# Altium schematic sheet Плата 347.SchDoc
size 420 x 297 mm; SheetNumber: 2; SheetTotal: 5
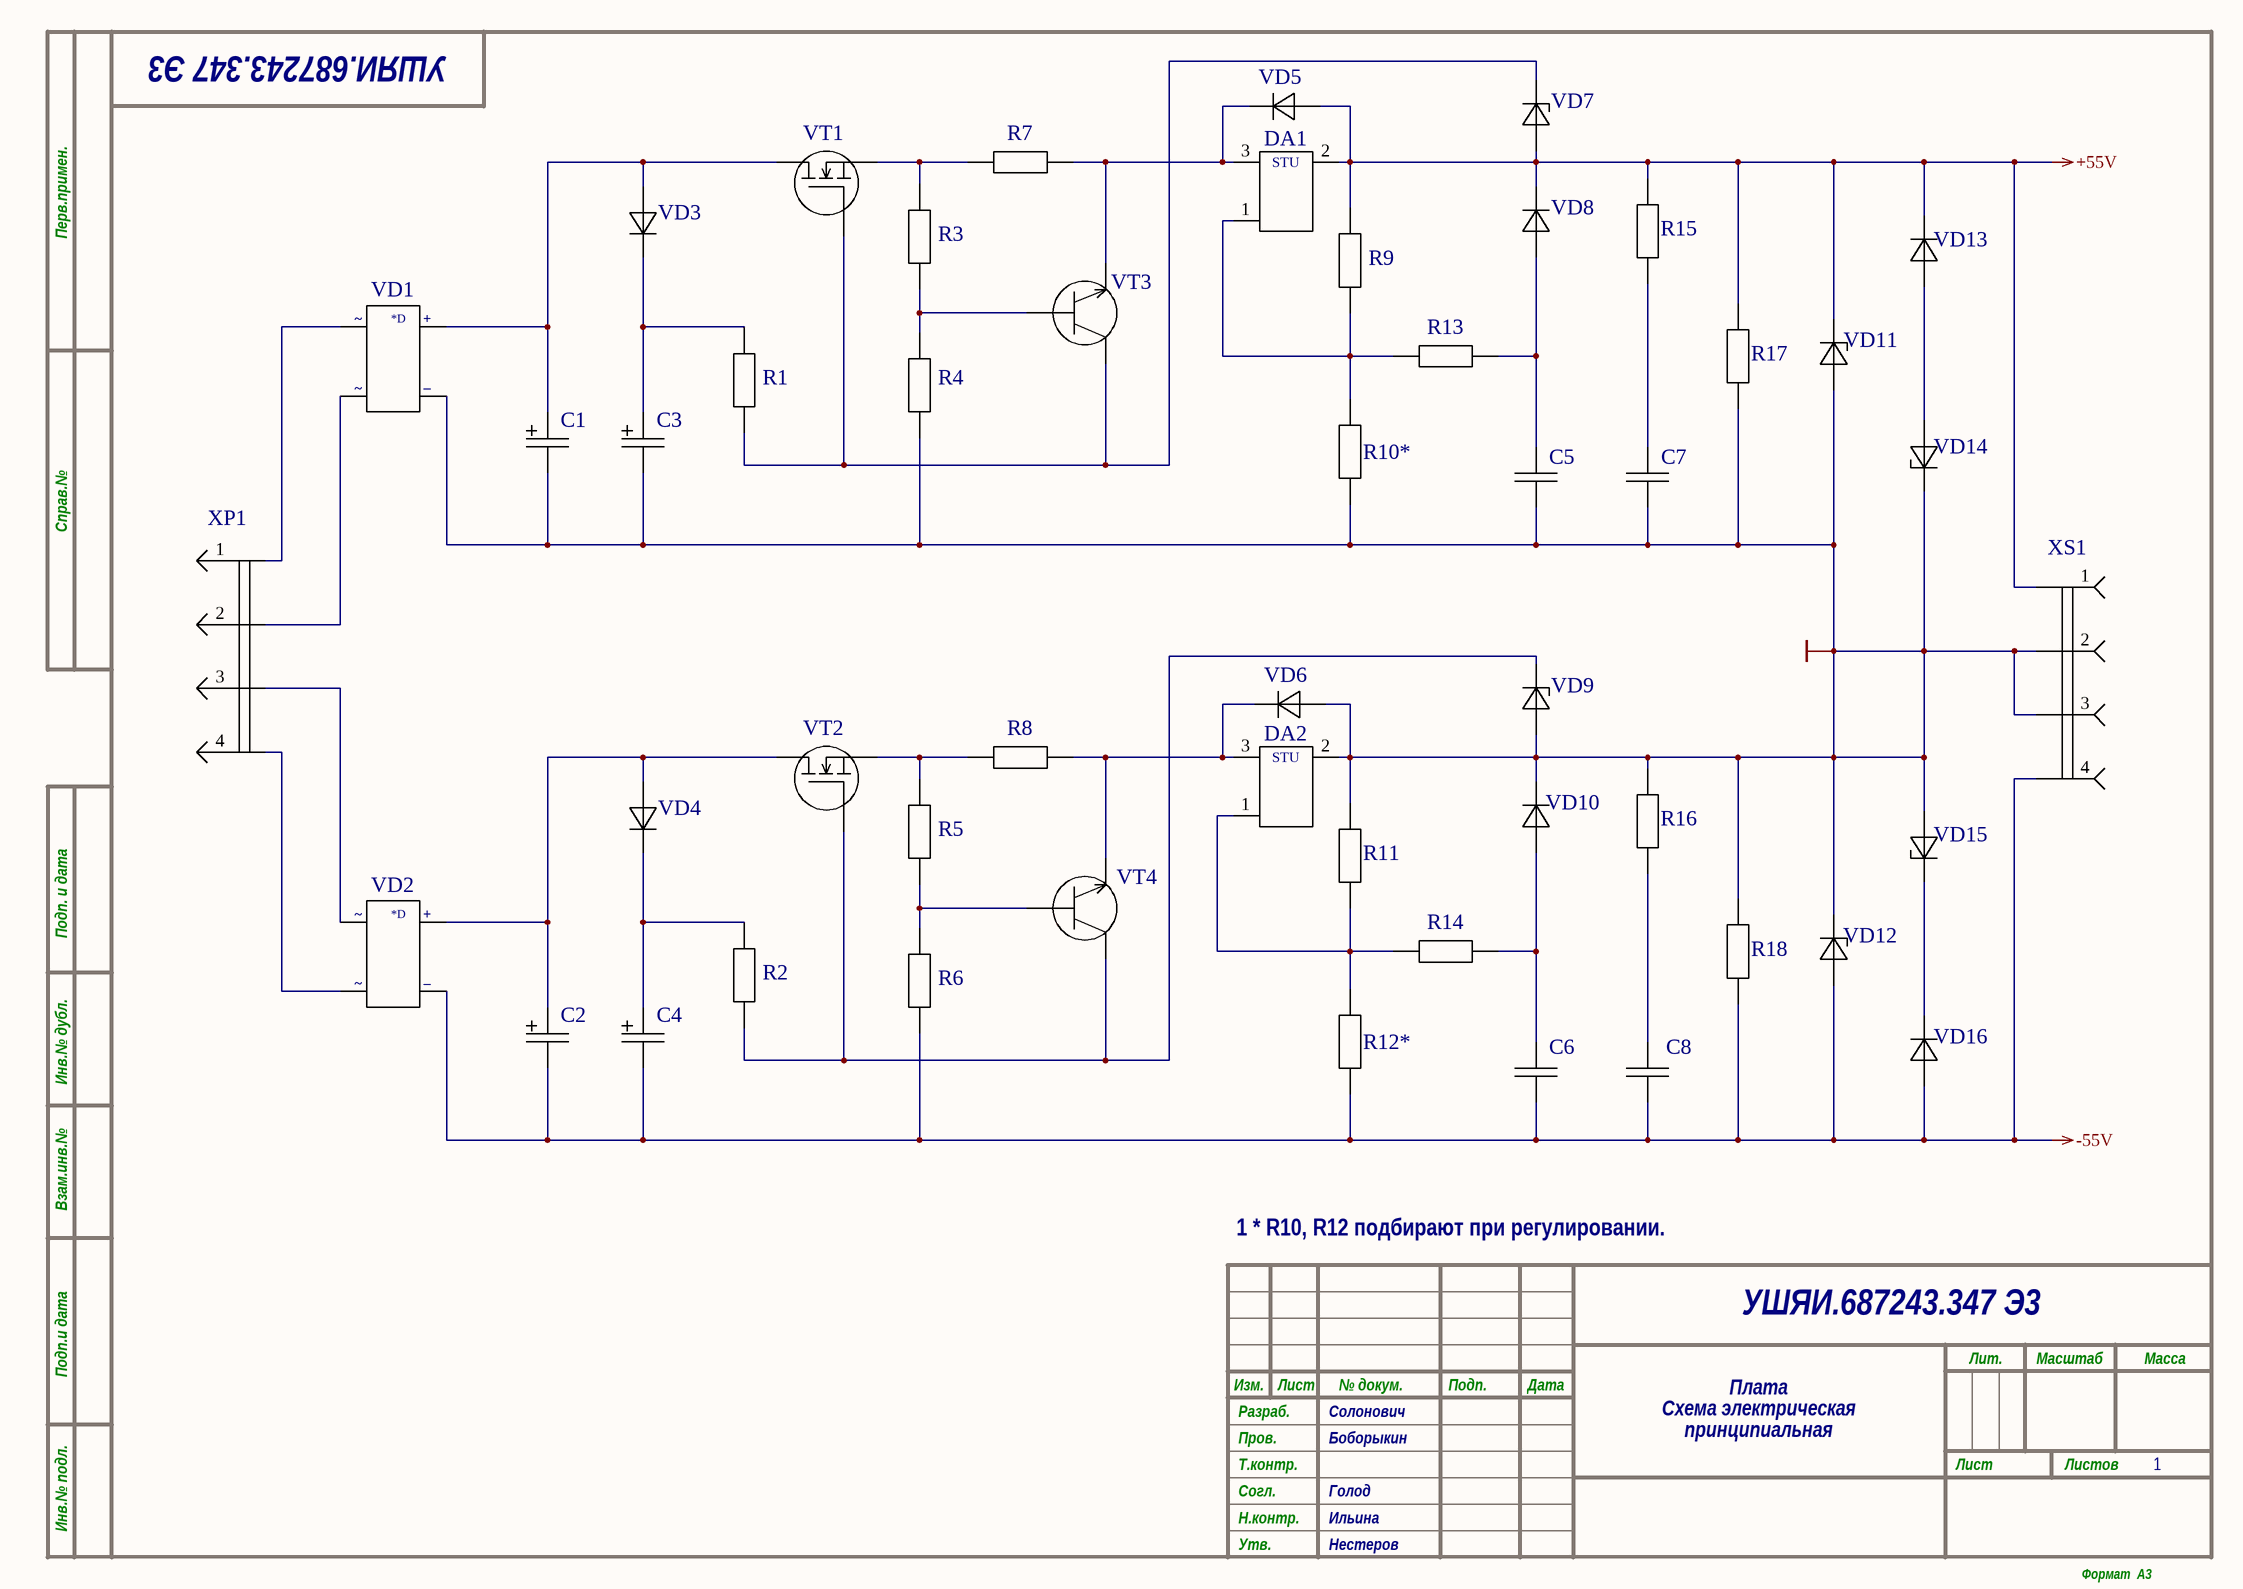
[diagram p0: Плата 347.SchDoc]

## Parts
C1  Полярный конденсатор  (value not drawn)
C2  Полярный конденсатор  (value not drawn)
C3  Полярный конденсатор  (value not drawn)
C4  Полярный конденсатор  (value not drawn)
C5  Конденсатор  (value not drawn)
C6  Конденсатор  (value not drawn)
C7  Конденсатор  (value not drawn)
C8  Конденсатор  (value not drawn)
DA1  Микросхема  (value not drawn)
DA2  Микросхема  (value not drawn)
R1  Резистор  (value not drawn)
R2  Резистор  (value not drawn)
R3  Резистор  (value not drawn)
R4  Резистор  (value not drawn)
R5  Резистор  (value not drawn)
R6  Резистор  (value not drawn)
R7  Резистор  (value not drawn)
R8  Резистор  (value not drawn)
R9  Резистор  (value not drawn)
R10*  Резистор  (value not drawn)
R11  Резистор  (value not drawn)
R12*  Резистор  (value not drawn)
R13  Резистор  (value not drawn)
R14  Резистор  (value not drawn)
R15  Резистор  (value not drawn)
R16  Резистор  (value not drawn)
R17  Резистор  (value not drawn)
R18  Резистор  (value not drawn)
VD1  Диодный мост  (value not drawn)
VD2  Диодный мост  (value not drawn)
VD3  Диод  (value not drawn)
VD4  Диод  (value not drawn)
VD5  Диод  (value not drawn)
VD6  Диод  (value not drawn)
VD7  Стабилитрон  (value not drawn)
VD8  Диод  (value not drawn)
VD9  Стабилитрон  (value not drawn)
VD10  Диод  (value not drawn)
VD11  Стабилитрон  (value not drawn)
VD12  Стабилитрон  (value not drawn)
VD13  Диод  (value not drawn)
VD14  Стабилитрон  (value not drawn)
VD15  Стабилитрон  (value not drawn)
VD16  Диод  (value not drawn)
VT1  Индуцированный транзистор  (value not drawn)
VT2  Индуцированный транзистор  (value not drawn)
VT3  Транзистор  (value not drawn)
VT4  Транзистор  (value not drawn)
XP1  Вилка 4 пин  (value not drawn)
XS1  Розетка 4 пин  (value not drawn)

## Nets
+55V: DA1.2 R9.2 R15.1 R17.1 VD5.2 VD7.2 VD8.1 VD11.1 VD13.1 XS1.1
-55V: C2.2 C4.2 C6.2 C8.1 R6.1 R12*.1 R18.2 VD2.2 VD12.2 VD16.2 XS1.4
GND: C1.2 C3.2 C5.2 C7.1 DA2.2 R4.1 R10*.1 R11.2 R16.1 R17.2 R18.1 VD1.2 VD6.2 VD9.2 VD10.1 VD11.2 VD12.1 VD14.1 VD15.2 XS1.2 XS1.3
NetC1_1: C1.1 VD1.3 VD3.2 VT1.2
NetC2_1: C2.1 VD2.3 VD4.2 VT2.2
NetC3_1: C3.1 R1.2 VD3.1
NetC4_1: C4.1 R2.2 VD4.1
NetC5_1: C5.1 R13.1 VD8.2
NetC6_1: C6.1 R14.1 VD10.2
NetC7_2: C7.2 R15.2
NetC8_2: C8.2 R16.2
NetDA1_1: DA1.1 R9.1 R10*.2 R13.2
NetDA1_3: DA1.3 R7.1 VD5.1 VT3.2
NetDA2_1: DA2.1 R11.1 R12*.2 R14.2
NetDA2_3: DA2.3 R8.1 VD6.1 VT4.2
NetR1_1: R1.1 VD7.1 VT1.1 VT3.3
NetR2_1: R2.1 VD9.1 VT2.1 VT4.3
NetR3_1: R3.1 R4.2 VT3.1
NetR3_2: R3.2 R7.2 VT1.3
NetR5_1: R5.1 R6.2 VT4.1
NetR5_2: R5.2 R8.2 VT2.3
NetVD1_1: VD1.1 XP1.1
NetVD1_3: VD1.3 XP1.2
NetVD2_1: VD2.1 XP1.3
NetVD2_3: VD2.3 XP1.4
NetVD13_2: VD13.2 VD14.2
NetVD15_1: VD15.1 VD16.1

## Notes on the sheet
- УШЯИ.687243.347 Э3
- 1 * R10, R12 подбирают при регулировании.
- Солонович
- Плата
- Схема электрическая
- Боборыкин
- принципиальная
- 1
- Голод
- Нестеров
- Ильина
- Перв.примен.
- Справ.№
- Подп. и дата
- Инв.№ дубл.
- Взам.инв.№
- Подп.и дата
- Разраб.
- Изм.
- Лист
- № докум.
- Подп.
- Дата
- Лит.
- Масштаб
- Масса
- Т.контр.
- Пров.
- Листов
- Инв.№ подл.
- Утв.
- Н.контр.
- Согл.
- Формат  A3
- (in symbol Диодный мост) ~; +; *D; _
- (in symbol Микросхема) STU